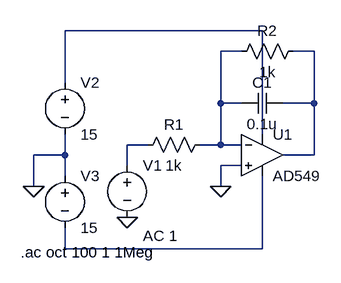
[diagram p0: schematic LowPassFilter1.asc]
LowPassFilter1.asc, the LTspice schematic file:
Version 4
SHEET 1 880 680
WIRE 128 -64 -176 -64
WIRE 96 -32 64 -32
WIRE 208 -32 176 -32
WIRE -176 16 -176 -64
WIRE 64 48 64 -32
WIRE 96 48 64 48
WIRE 208 48 208 -32
WIRE 208 48 160 48
WIRE 128 96 128 -64
WIRE -48 112 -80 112
WIRE 64 112 64 48
WIRE 64 112 32 112
WIRE 96 112 64 112
WIRE -176 128 -176 96
WIRE -176 128 -224 128
WIRE 208 128 208 48
WIRE 208 128 160 128
WIRE -80 144 -80 112
WIRE 96 144 64 144
WIRE -176 160 -176 128
WIRE -224 176 -224 128
WIRE 64 176 64 144
WIRE -176 272 -176 240
WIRE 128 272 128 160
WIRE 128 272 -176 272
FLAG -80 224 0
FLAG 64 176 0
FLAG -224 176 0
SYMBOL Opamps\\AD549 128 64 R0
SYMATTR InstName U1
SYMBOL res 48 96 R90
WINDOW 0 0 56 VBottom 2
WINDOW 3 32 56 VTop 2
SYMATTR InstName R1
SYMATTR Value 1k
SYMBOL cap 160 32 R90
WINDOW 0 0 32 VBottom 2
WINDOW 3 32 32 VTop 2
SYMATTR InstName C1
SYMATTR Value 0.1u
SYMBOL voltage -80 128 R0
WINDOW 123 24 124 Left 2
WINDOW 39 0 0 Left 0
SYMATTR InstName V1
SYMATTR Value ""
SYMATTR Value2 AC 1
SYMBOL voltage -176 0 R0
WINDOW 123 0 0 Left 0
WINDOW 39 0 0 Left 0
SYMATTR InstName V2
SYMATTR Value 15
SYMBOL voltage -176 144 R0
WINDOW 123 0 0 Left 0
WINDOW 39 0 0 Left 0
SYMATTR InstName V3
SYMATTR Value 15
SYMBOL res 192 -48 R90
WINDOW 0 0 56 VBottom 2
WINDOW 3 32 56 VTop 2
SYMATTR InstName R2
SYMATTR Value 1k
TEXT -244 278 Left 2 !.ac oct 100 1 1Meg

The netlist it stands for:
* LowPassFilter1.asc
XU1 0 N002 N001 N005 N003 AD549  ; pins In+ In- V+ V- OUT
R1 N002 N004 1k
C1 N003 N002 0.1u
V1 N004 0 AC 1
V2 N001 0 15
V3 0 N005 15
R2 N003 N002 1k
.ac oct 100 1 1Meg
.backanno
.end